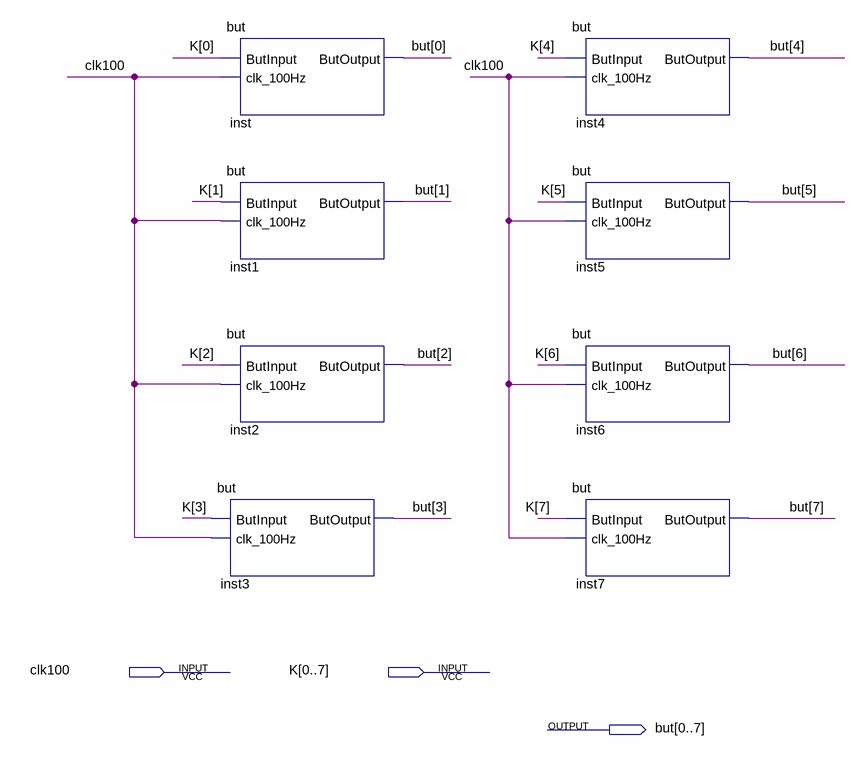
[diagram p0: schematic sheet]
// Quartus schematic butpro.bdf as structural Verilog: 8 symbols, 3 pins
module butpro (
  input  clk100,
  input  [0:7] K,
  output [0:7] but
);

  but inst (.ButInput(K[0]), .clk_100Hz(clk100), .ButOutput(but[0]));
  but inst1 (.ButInput(K[1]), .clk_100Hz(clk100), .ButOutput(but[1]));
  but inst2 (.ButInput(K[2]), .clk_100Hz(clk100), .ButOutput(but[2]));
  but inst3 (.ButInput(K[3]), .clk_100Hz(clk100), .ButOutput(but[3]));
  but inst4 (.ButInput(K[4]), .clk_100Hz(clk100), .ButOutput(but[4]));
  but inst5 (.ButInput(K[5]), .clk_100Hz(clk100), .ButOutput(but[5]));
  but inst6 (.ButInput(K[6]), .clk_100Hz(clk100), .ButOutput(but[6]));
  but inst7 (.ButInput(K[7]), .clk_100Hz(clk100), .ButOutput(but[7]));
endmodule
